# EAGLE design VK49_2.0 (EAGLE 9.6.2)
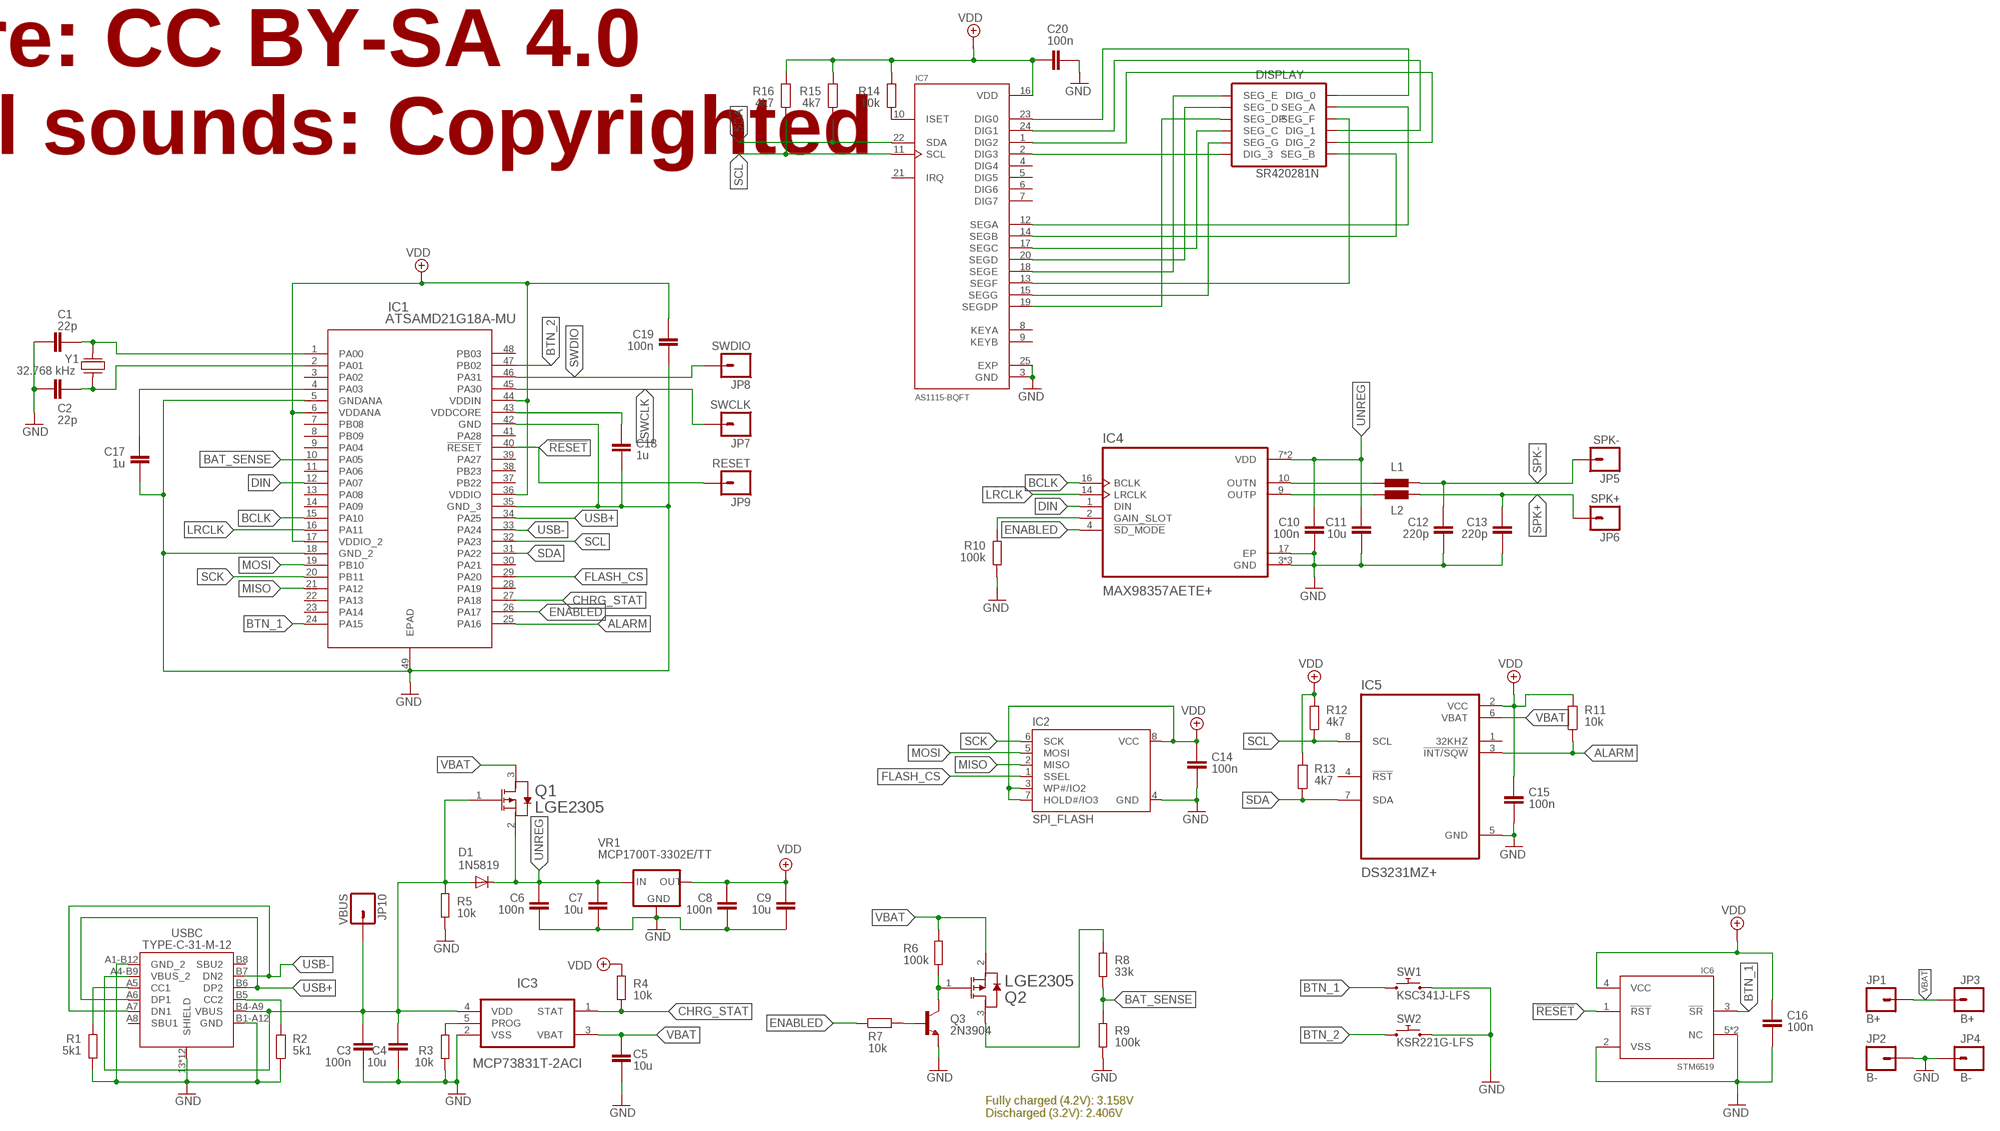
[diagram p0: schematic, sheet 1]

## Parts
C1  22p  CAPACITOR0603  [CAPACITOR0603]
C2  22p  CAPACITOR0603  [CAPACITOR0603]
C3  100n  CAPACITOR0603  [CAPACITOR0603]
C4  10u  CAPACITOR0805  [CAPACITOR0805]
C5  10u  CAPACITOR0805  [CAPACITOR0805]
C6  100n  CAPACITOR0603  [CAPACITOR0603]
C7  10u  CAPACITOR0805  [CAPACITOR0805]
C8  100n  CAPACITOR0603  [CAPACITOR0603]
C9  10u  CAPACITOR0805  [CAPACITOR0805]
C10  100n  CAPACITOR0603  [CAPACITOR0603]
C11  10u  CAPACITOR0805  [CAPACITOR0805]
C12  220p  CAPACITOR0603  [CAPACITOR0603]
C13  220p  CAPACITOR0603  [CAPACITOR0603]
C14  100n  CAPACITOR0603  [CAPACITOR0603]
C15  100n  CAPACITOR0603  [CAPACITOR0603]
C16  100n  CAPACITOR0603  [CAPACITOR0603]
C17  1u  CAPACITOR0603  [CAPACITOR0603]
C18  1u  CAPACITOR0603  [CAPACITOR0603]
C19  100n  CAPACITOR0603  [CAPACITOR0603]
C20  100n  CAPACITOR0603  [CAPACITOR0603]
D1  1N5819  CRS01  [SOD123]
DISPLAY  SR420281N  SEG_SR420281N_NOSILK  [SEG_SR420281N_NO-SILK]
IC1  ATSAMD21G18A-MU  [QFN-48-7X7]
IC2  SPI_FLASH  [SO08-EIAJ]
IC3  MCP73831T-2ACI  [SOT23-5]
IC4  MAX98357AETE+  [QFN50P300X300X80-17N]
IC5  DS3231MZ+  [SO8]
IC6  STM6519  [SON50P145X100X65-6N]
IC7  AS1115-BQFT  [QFN50P400X400X65-25N]
JP1  B+  M01_ROUND_NO_SILK  [1X01_ROUND_NOSILK]
JP2  B-  M01_ROUND_NO_SILK  [1X01_ROUND_NOSILK]
JP3  B+  M01_ROUND_NO_SILK  [1X01_ROUND_NOSILK]
JP4  B-  M01_ROUND_NO_SILK  [1X01_ROUND_NOSILK]
JP5  SPK-  M01_ROUND_NO_SILK  [1X01_ROUND_NOSILK]
JP6  SPK+  M01_ROUND_NO_SILK  [1X01_ROUND_NOSILK]
JP7  SWCLK  M01_ROUND_NO_SILK  [1X01_ROUND_NOSILK]
JP8  SWDIO  M01_ROUND_NO_SILK  [1X01_ROUND_NOSILK]
JP9  RESET  M01_ROUND_NO_SILK  [1X01_ROUND_NOSILK]
JP10  VBUS  M01_ROUND_NO_SILK  [1X01_ROUND_NOSILK]
L1  MMZ1608B121CTAH0  BLM15H0603  [0603]
L2  MMZ1608B121CTAH0  BLM15H0603  [0603]
Q1  LGE2305  [SOT23]
Q2  LGE2305  [SOT23]
Q3  2N3904  [SOT23]
R1  5k1  RESISTOR0603  [RESISTOR0603]
R2  5k1  RESISTOR0603  [RESISTOR0603]
R3  10k  RESISTOR0603  [RESISTOR0603]
R4  10k  RESISTOR0603  [RESISTOR0603]
R5  10k  RESISTOR0603  [RESISTOR0603]
R6  100k  RESISTOR0603  [RESISTOR0603]
R7  10k  RESISTOR0603  [RESISTOR0603]
R8  33k  RESISTOR0603  [RESISTOR0603]
R9  100k  RESISTOR0603  [RESISTOR0603]
R10  100k  RESISTOR0603  [RESISTOR0603]
R11  10k  RESISTOR0603  [RESISTOR0603]
R12  4k7  RESISTOR0603  [RESISTOR0603]
R13  4k7  RESISTOR0603  [RESISTOR0603]
R14  10k  RESISTOR0603  [RESISTOR0603]
R15  4k7  RESISTOR0603  [RESISTOR0603]
R16  4k7  RESISTOR0603  [RESISTOR0603]
SW1  KSC341J-LFS  KSC3XXJ  [KSC3XXJ]
SW2  KSR221G-LFS  KSR2XXG  [KSR2XXG]
USBC  TYPE-C-31-M-12  USB-C  [USB-C]
VR1  MCP1700T-3302E/TT  [SOT23]
Y1  32.768 kHz  CRYSTAL_3.2X1.5  [3.2X1.5-2-PAD]

## Nets
!RESET: IC1.40(!RESET) IC6.1(!RST) JP9.1
ALARM: IC1.25(PA16) IC5.3(!INT/SQW) R11.1
BAT_SENSE: IC1.10(PA05) R8.2 R9.1
BCLK: IC1.15(PA10) IC4.16(BCLK)
BTN_1: IC1.24(PA15) IC6.3(!SR) SW1.1 SW1.3
BTN_2: IC1.47(PB02) SW2.1
CHRG_STAT: IC1.27(PA18) IC3.1(STAT) R4.1
DIN: IC1.12(PA07) IC4.1(DIN)
ENABLED: IC1.26(PA17) IC4.4(!SD_MODE) R7.1
FLASH_CS: IC1.29(PA20) IC2.1(SSEL)
GND: C1.1 C2.1 C3.1 C4.2 C5.2 C6.1 C7.2 C8.1 C9.2 C10.1 C11.2 C12.1 C13.1 C14.1 C15.1 C16.1 C17.1 C18.1 C19.1 C20.1 IC1.5(GNDANA) IC1.18(GND_2) IC1.35(GND_3) IC1.42(GND) IC1.49(EPAD) IC2.4(GND) IC3.2(VSS) IC4.3(GND) IC4.11(GND) IC4.15(GND) IC4.17(EP) IC5.5(GND) IC6.2(VSS) IC6.5(NC) IC6.6(NC) IC7.3(GND) IC7.25(EXP) JP2.1 JP4.1 Q3.2(E) R1.1 R2.1 R3.2 R5.1 R9.2 R10.1 SW1.2 SW1.4 SW2.2 USBC.13(SHIELD) USBC.14(SHIELD) USBC.15(SHIELD) USBC.16(SHIELD) USBC.A1-B12(GND_2) USBC.B1-A12(GND) USBC.S_1_H1(SHIELD) USBC.S_1_H2(SHIELD) USBC.S_2_H1(SHIELD) USBC.S_2_H2(SHIELD) USBC.S_3_H1(SHIELD) USBC.S_3_H2(SHIELD) USBC.S_4_H1(SHIELD) USBC.S_4_H2(SHIELD) VR1.GND
LRCLK: IC1.16(PA11) IC4.14(LRCLK)
MISO: IC1.21(PA12) IC2.2(MISO)
MOSI: IC1.19(PB10) IC2.5(MOSI)
N$1: C1.2 IC1.1(PA00) Y1.1
N$2: C2.2 IC1.2(PA01) Y1.2
N$3: IC7.10(ISET) R14.1
N$4: R1.2 USBC.A5(CC1)
N$5: R2.2 USBC.B5(CC2)
N$6: C18.2 IC1.43(VDDCORE)
N$7: IC3.5(PROG) R3.1
N$8: IC4.10(OUTN) L1.1
N$9: IC4.9(OUTP) L2.1
N$10: IC4.2(GAIN_SLOT) R10.2
N$11: C17.2 IC1.4(PA03)
N$12: DISPLAY.12(DIG_0) IC7.23(DIG0)
N$13: DISPLAY.9(DIG_1) IC7.24(DIG1)
N$14: DISPLAY.8(DIG_2) IC7.1(DIG2)
N$15: DISPLAY.6(DIG_3) IC7.2(DIG3)
N$16: DISPLAY.11(SEG_A) IC7.12(SEGA)
N$17: DISPLAY.7(SEG_B) IC7.14(SEGB)
N$18: DISPLAY.4(SEG_C) IC7.17(SEGC)
N$19: DISPLAY.2(SEG_D) IC7.20(SEGD)
N$20: DISPLAY.1(SEG_E) IC7.18(SEGE)
N$21: DISPLAY.10(SEG_F) IC7.13(SEGF)
N$22: DISPLAY.5(SEG_G) IC7.15(SEGG)
N$23: DISPLAY.3(SEG_DP) IC7.19(SEGDP)
N$52: Q2.3(DRAIN) R8.1
N$67: Q2.1(GATE) Q3.3(C) R6.2
N$68: Q3.1(B) R7.2
SCK: IC1.20(PB11) IC2.6(SCK)
SCL: IC1.32(PA23) IC5.8(SCL) IC7.11(SCL) R12.1 R16.1
SDA: IC1.31(PA22) IC5.7(SDA) IC7.22(SDA) R13.1 R15.1
SPK+: C13.2 JP6.1 L2.2
SPK-: C12.2 JP5.1 L1.2
SWCLK: IC1.45(PA30) JP7.1
SWDIO: IC1.46(PA31) JP8.1
UNREG: C6.2 C7.1 C10.2 C11.1 D1.C IC4.7(VDD) IC4.8(VDD) Q1.2(SOURCE) VR1.VIN(IN)
USB+: IC1.34(PA25) USBC.A6(DP1) USBC.B6(DP2)
USB-: IC1.33(PA24) USBC.A7(DN1) USBC.B7(DN2)
VBAT: C5.1 IC3.3(VBAT) IC5.6(VBAT) JP1.1 JP3.1 Q1.3(DRAIN) Q2.2(SOURCE) R6.1
VBUS: C3.2 C4.1 D1.A IC3.4(VDD) JP10.1 Q1.1(GATE) R5.2 USBC.A4-B9(VBUS_2) USBC.B4-A9(VBUS)
VDD: C8.2 C9.1 C14.2 C15.2 C16.2 C19.2 C20.2 IC1.6(VDDANA) IC1.17(VDDIO_2) IC1.36(VDDIO) IC1.44(VDDIN) IC2.3(WP#/IO2) IC2.7(HOLD#/IO3) IC2.8(VCC) IC5.2(VCC) IC6.4(VCC) IC7.16(VDD) R4.2 R11.2 R12.2 R13.2 R14.2 R15.2 R16.2 VR1.VOUT(OUT)
Unconnected: IC1.3(PA02) IC1.7(PB08) IC1.8(PB09) IC1.9(PA04) IC1.11(PA06) IC1.13(PA08) IC1.14(PA09) IC1.22(PA13) IC1.23(PA14) IC1.28(PA19) IC1.30(PA21) IC1.37(PB22) IC1.38(PB23) IC1.39(PA27) IC1.41(PA28) IC1.48(PB03) IC5.1(32KHZ) IC5.4(!RST) IC7.4(DIG4) IC7.5(DIG5) IC7.6(DIG6) IC7.7(DIG7) IC7.8(KEYA) IC7.9(KEYB) IC7.21(IRQ) USBC.A8(SBU1) USBC.B8(SBU2)

## Notes on the sheet
- VK49 2.0
  Vaclav Mach (vaclavmach@hotmail.cz)
  Hardware: CC BY-SA 4.0
  Software: CC BY-SA 4.0
  Original sounds: Copyrighted
- Fully charged (4.2V): 3.158V
  Discharged (3.2V): 2.406V

## Library data of the parts
C1-C3 C6 C8 C10 C12-C20 = BASTL_CAPACITORS:CAPACITOR0603; ODOO: 0.1; SIZEX: 0.85; SIZEY: 1.55; SIZEZ: 0.8; TYPE: SMT
C4 C5 C7 C9 C11 = BASTL_CAPACITORS:CAPACITOR0805; ODOO: 0.1; SIZEX: 1.2; SIZEY: 2; SIZEZ: 1.2; TYPE: SMT
D1 = BASTL_DIODES:CRS01: diode instead of 1N4007; MAN: TOSHIBA; MPN: CRS01(TE85L,Q,M); ODOO: D_CRS01_SOD123F; PRICE: 2.1; SIZEX: 1.55; SIZEY: 2.65; SIZEZ: 0.9; TYPE: SMT; WEB: https://www.tme.eu/cz/details/crs01/diody-schottky-smd/toshiba/crs01-te85l-q-m/
DISPLAY = BASTL_LEDS:SEG_SR420281N
IC1 = BASTL_ICS:ATSAMD21G18A-MU; COPYRIGHT: Copyright (C) 2022 Ultra Librarian. All rights reserved.; DIGI-KEY_PART_NUMBER_1: ATSAMD21G18A-MUTCT-ND; DIGI-KEY_PART_NUMBER_2: ATSAMD21G18A-MUTDKR-ND; DIGI-KEY_PART_NUMBER_3: ATSAMD21G18A-MUTTR-ND; MANUFACTURER_PART_NUMBER: ATSAMD21G18A-MUT; MFR_NAME: Microchip
IC2 = BASTL_ICS:SPI_FLASH: Various SPI memory ICs: GD25Q64CSIG SST26VF064BT-104I/SM ...
IC3 = BASTL_ICS:MCP73831T-2ACI: Charge Management Controller; MPN: MCP73831T-2ACI/OT; OC_FARNELL: 1332158; OC_NEWARK: 56K7045; PACKAGE: SOT-5; SUPPLIER: Microchip
IC4 = BASTL_ICS:MAX98357AETE+: Audio Amp Speaker 1-CH Mono Class-D 16-Pin TQFN EP Check availability <https://pricing.snapeda.com/parts/MAX98357AETE%2B/Analog%20Devices/view-part?ref=eda>; AVAILABILITY: In Stock; DESCRIPTION: Tiny, Low-Cost, PCM Class D Amplifier with Class AB Performance; MF: Analog Devices; MP: MAX98357AETE+; PACKAGE: TQFN-16 Maxim; PRICE: None; PURCHASE-URL: https://pricing.snapeda.com/search/part/MAX98357AETE+/?ref=eda
IC5 = BASTL_ICS:DS3231MZ+; DESCRIPTION: Real Time Clock (RTC) IC Clock/Calendar I²C, 2-Wire Serial 8-SOIC (0.154, 3.90mm Width); DIGI-KEY_PART_NUMBER: DS3231MZ+-ND; MF: Maxim Integrated Products; MP: DS3231MZ+; PACKAGE: None
IC6 = BASTL_ICS:STM6519; DESCRIPTION: Cap Tant Solid 6.8uF 35V G CASE 10% (6.73 X 2.79 X 2.79mm) SMD (0.01%FR) T/R; MF: STMicroelectronics; MP: STM6519AHARUB6F; PACKAGE: UDFN-6 STMicroelectronics; PURCHASE-URL: https://pricing.snapeda.com/search/part/STM6519AHARUB6F/?ref=eda
IC7 = BASTL_ICS:AS1115-BQFT; DESCRIPTION: IC DRVR 64 LED 7SEG 8 DGT 24TQFN; DIGI-KEY_PART_NUMBER: AS1115-BQFTTR-ND; MF: ams; MP: AS1115-BQFT; PACKAGE: TQFN-24 ams; PURCHASE-URL: https://pricing.snapeda.com/search/part/AS1115-BQFT/?ref=eda
JP1-JP10 = BASTL_PINHEADERS:M01: Header 1 Standard 1-pin 0.1" header. Use with straight break away headers (SKU : PRT-00116), right angle break away headers (PRT-00553), swiss pins (PRT-00743), machine pins (PRT-00117), and female headers (PRT-00115).
L1 L2 = BASTL_INDUCTORS:BLM15H: EMIFIL (R) Chip Ferrite Bead for GHz Noise Source: http://www.murata.com/ Ferrite Bead BLM15H.pdf; SIZEX: 0.85; SIZEY: 1.55; SIZEZ: 0.5; TYPE: SMT
Q1 Q2 = BASTL_TRANZISTORS:LGE2305
Q3 = BASTL_TRANZISTORS:2N3904; ASSEMBLED: YES; MAN: ON SEMICONDUCTOR; MPN: MMBT3904LT1G; ODOO: TR_2N3904_SOT23; PRICE: 0.4; SIZEX: 2.92; SIZEY: 2.4; SIZEZ: 0.9; TYPE: SMT; WEB: https://www.tme.eu/cz/details/mmbt3904lt1g/tranzistory-npn-smd/on-semiconductor/
R1-R16 = BASTL_RESISTORS:RESISTOR0603; ASSEMBLED: yes; PRICE: 0.1; SIZEX: 0.85; SIZEY: 1.55; SIZEZ: 0.5; TYPE: SMT
SW1 = BASTL_SWITCHES:KSC3XXJ
SW2 = BASTL_SWITCHES:KSR2XXG
USBC = BASTL_CONNECTORS:USB-C: DigiKey: USB4105-GF-A LCSC: C165948
VR1 = BASTL_VOLTAGE REGULATORS:MCP1700T-3302E/TT
Y1 = BASTL_CRYSTALS, RESNATORS:CRYSTAL_3.2X1.5: Various 3.2 x 1.5 mm SMD crystals Eg. LFXTAL009678REEL

## Board
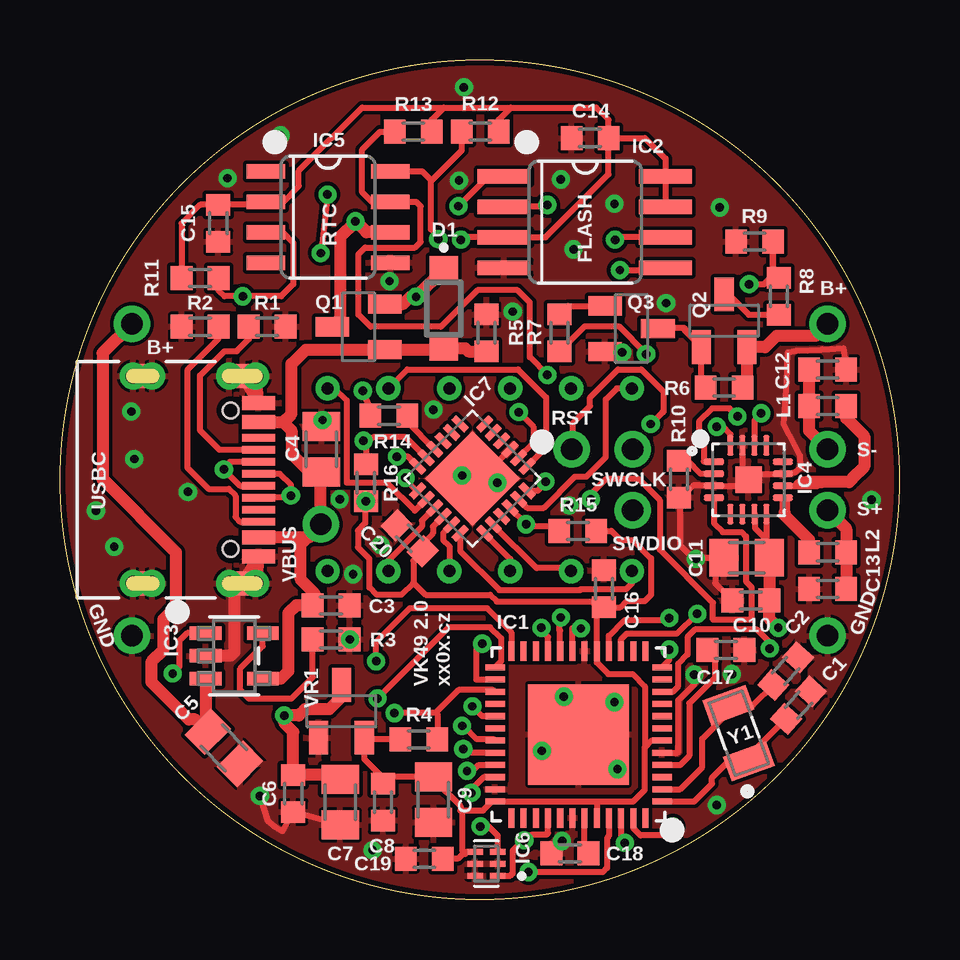
[diagram p1: board, top side]
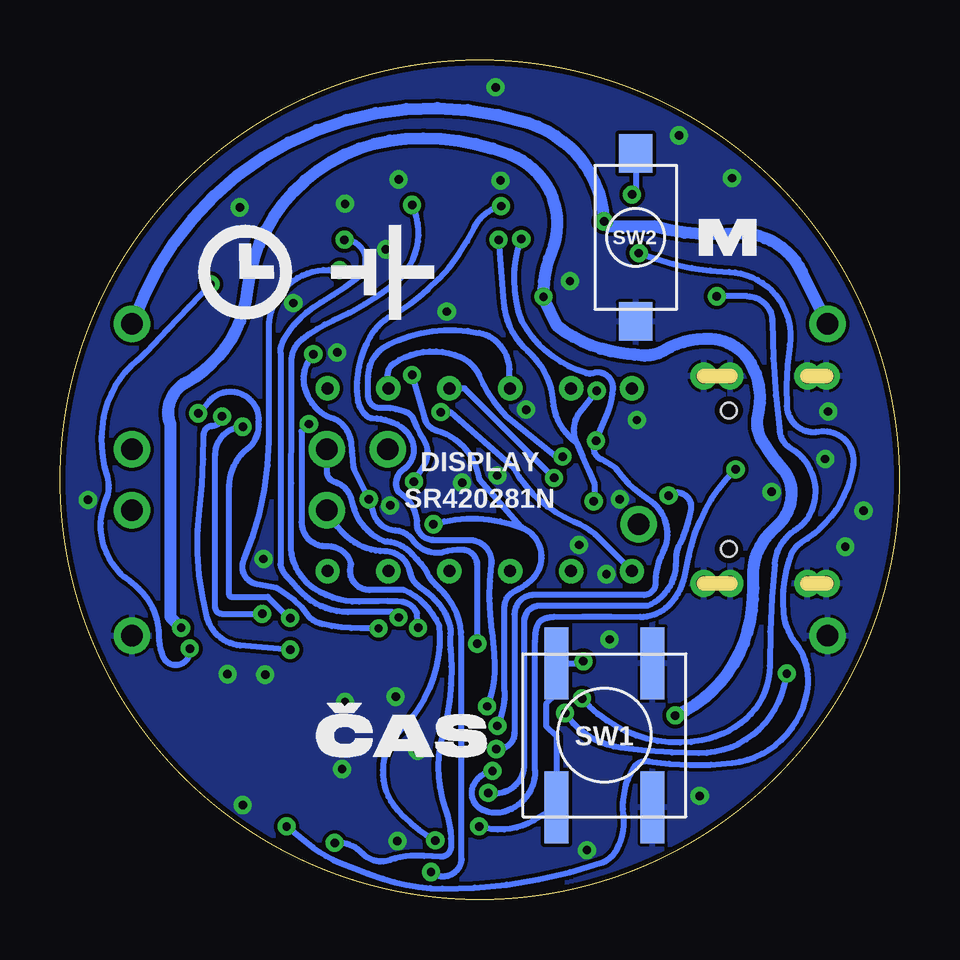
[diagram p2: board, bottom side, seen from below]

Size 35 x 35 mm. Coordinates in mm from the lower left corner, seen from the top.
Outline: circle at 17.5,17.5 radius 17.5
Copper layers (1*16): Top 0.035mm / dielectric 1.5mm / Bottom 0.035mm
Design rules "default_tenting_vias *": minimum track width 6mil, minimum drill 0.35mm, track to track 6mil, track to pad 6mil, pad to pad 6mil, via to via 6mil, smd to smd 6mil, copper to edge 10mil, drill to drill 6mil, minimum pad ring 10mil, minimum via ring 8mil, stop-mask expansion 4mil, vias tented up to drill 15mil, thermal gap 5mil

### Footprints (pad centres in the part's own frame; a part is rotated, then mirrored left to right if it is on the bottom)
CAPACITOR0603 = smd 0.9 x 1: 1 -0.771,0; 2 0.771,0
CAPACITOR0805 = smd 1.2 x 1.55: 1 -0.95,0; 2 0.95,0
SOD123 = smd 1.05 x 1.2: A 1.654,0; C -1.654,0
SEG_SR420281N_NO-SILK = drill 0.5: 1 -6.35,-3.81; 2 -3.81,-3.81; 3 -1.27,-3.81; 4 1.27,-3.81; 5 3.81,-3.81; 6 6.35,-3.81; 7 6.35,3.81; 8 3.81,3.81; 9 1.27,3.81; 10 -1.27,3.81; 11 -3.81,3.81; 12 -6.35,3.81
QFN-48-7X7 = smd 0.813 x 0.254: 1 -3.48,2.794; 2 -3.48,2.286; 3 -3.48,1.778; 4 -3.48,1.27; 5 -3.48,0.762; 6 -3.48,0.254; 7 -3.48,-0.254; 8 -3.48,-0.762; 9 -3.48,-1.27; 10 -3.48,-1.778; 11 -3.48,-2.286; 12 -3.48,-2.794; 25 3.48,-2.794; 26 3.48,-2.286; 27 3.48,-1.778; 28 3.48,-1.27; 29 3.48,-0.762; 30 3.48,-0.254; 31 3.48,0.254; 32 3.48,0.762; 33 3.48,1.27; 34 3.48,1.778; 35 3.48,2.286; 36 3.48,2.794 | smd 0.254 x 0.813: 13 -2.794,-3.48; 14 -2.286,-3.48; 15 -1.778,-3.48; 16 -1.27,-3.48; 17 -0.762,-3.48; 18 -0.254,-3.48; 19 0.254,-3.48; 20 0.762,-3.48; 21 1.27,-3.48; 22 1.778,-3.48; 23 2.286,-3.48; 24 2.794,-3.48; 37 2.794,3.48; 38 2.286,3.48; 39 1.778,3.48; 40 1.27,3.48; 41 0.762,3.48; 42 0.254,3.48; 43 -0.254,3.48; 44 -0.762,3.48; 45 -1.27,3.48; 46 -1.778,3.48; 47 -2.286,3.48; 48 -2.794,3.48 | smd 4.191 x 4.191: 49 0,0
SO08-EIAJ = smd 0.61 x 2.21: 1 -1.905,-3.378; 2 -0.635,-3.378; 3 0.635,-3.378; 4 1.905,-3.378; 5 1.905,3.353; 6 0.635,3.353; 7 -0.635,3.353; 8 -1.905,3.353
SOT23-5 = smd 1.321 x 0.559: 1 -1.194,0.95; 2 -1.194,0; 3 -1.194,-0.95; 4 1.194,-0.95; 5 1.194,0.95
QFN50P300X300X80-17N = smd 0.86 x 0.27: 1 -1.435,0.75; 2 -1.435,0.25; 3 -1.435,-0.25; 4 -1.435,-0.75; 9 1.435,-0.75; 10 1.435,-0.25; 11 1.435,0.25; 12 1.435,0.75 | smd 0.27 x 0.86: 5 -0.75,-1.435; 6 -0.25,-1.435; 7 0.25,-1.435; 8 0.75,-1.435; 13 0.75,1.435; 14 0.25,1.435; 15 -0.25,1.435; 16 -0.75,1.435 | smd 1.1 x 1.1: 17 0,0
SO8 = smd 1.6 x 0.6: 1 -2.6,1.905; 2 -2.6,0.635; 3 -2.6,-0.635; 4 -2.6,-1.905; 5 2.6,-1.905; 6 2.6,-0.635; 7 2.6,0.635; 8 2.6,1.905
SON50P145X100X65-6N = smd 0.65 x 0.25: 1 -0.475,0.5; 2 -0.475,0; 3 -0.475,-0.5; 4 0.475,-0.5; 5 0.475,0; 6 0.475,0.5
QFN50P400X400X65-25N = smd 0.76 x 0.3: 1 -1.975,1.25; 2 -1.975,0.75; 3 -1.975,0.25; 4 -1.975,-0.25; 5 -1.975,-0.75; 6 -1.975,-1.25; 13 1.975,-1.25; 14 1.975,-0.75; 15 1.975,-0.25; 16 1.975,0.25; 17 1.975,0.75; 18 1.975,1.25 | smd 0.3 x 0.76: 7 -1.25,-1.975; 8 -0.75,-1.975; 9 -0.25,-1.975; 10 0.25,-1.975; 11 0.75,-1.975; 12 1.25,-1.975; 19 1.25,1.975; 20 0.75,1.975; 21 0.25,1.975; 22 -0.25,1.975; 23 -0.75,1.975; 24 -1.25,1.975 | smd 2.8 x 2.8: 25 0,0
1X01_ROUND_NOSILK = drill 0.889 pad 1.524: 1 0,0
0603 = smd 0.9 x 1: 1 -0.771,0; 2 0.771,0
SOT23 = smd 0.8 x 1.4: 1 -0.95,-1.1; 2 0.95,-1.1; 3 0,1.1
RESISTOR0603 = smd 0.9 x 1: 1 -0.771,0; 2 0.771,0
KSC3XXJ = smd 3 x 1: 1 -3,2; 2 -3,-2; 3 3,2; 4 3,-2
KSR2XXG = smd 1.6 x 1.4: 1 -3.5,0; 2 3.5,0
USB-C = smd 0.991 x 1.803: 13 -4.32,-1.269; 14 4.32,-1.269 | smd 0.991 x 2.108: 15 -4.32,2.911; 16 4.32,2.911 | smd 0.584 x 1.372: A1-B12 -3.2,3.581; A4-B9 -2.4,3.581; B1-A12 3.2,3.581; B4-A9 2.4,3.581 | smd 0.305 x 1.372: A5 -1.25,3.581; A6 -0.25,3.581; A7 0.25,3.581; A8 1.25,3.581; B5 1.75,3.581; B6 0.75,3.581; B7 -0.75,3.581; B8 -1.75,3.581 | drill 0.61 pad 0.61: S_1_H1 -4.318,-0.864; S_1_H2 -4.318,-1.651; S_2_H1 4.318,-0.864; S_2_H2 4.318,-1.651; S_3_H1 -4.318,3.454; S_3_H2 -4.318,2.362; S_4_H1 4.318,3.454; S_4_H2 4.318,2.362 | hole 0.65: 2.896,2.413; -2.896,2.413
SOT23' = smd 0.8 x 1.4: GND -0.95,-1.1; VIN 0,1.1; VOUT 0.95,-1.1
3.2X1.5-2-PAD = smd 1.1 x 1.9: 1 -1.25,0; 2 1.25,0

### Placement (x,y rotation side)
C1  30.78,8.1 228 top
C2  30.25,9.53 228 top
C3  11.3,12.27 180 top
C4  10.9,18.77 90 top
C5  6.83,6.32 315 top
C6  9.73,4.42 90 top
C7  11.68,4.06 270 top
C8  13.46,4.06 90 top
C9  15.57,4.17 270 top
C10  28.8,12.47 0 top
C11  28.63,14.25 180 top
C12  32,22.1 180 top
C13  32,12.95 0 top
C14  22.1,31.75 0 top
C15  6.6,28.19 90 top
C16  22.68,12.95 270 top
C17  27.76,10.41 180 top
C18  21.26,1.93 0 top
C19  15.19,1.7 0 top
C20  14.58,15.06 315 top
D1  16,24.64 270 top
DISPLAY  17.5,17.5 0 bottom
IC1  21.62,6.88 180 top
IC2  21.89,28.24 270 top
IC3  7.26,10.16 0 top
IC4  28.7,17.5 0 top
IC5  11.18,28.45 0 top
IC6  17.78,1.5 180 top
IC7  17.2,17.55 225 top
JP1  3,24 0 top
JP2  3,11 0 top
JP3  32,24 0 top
JP4  32,11 0 top
JP5  32,18.77 0 top
JP6  32,16.23 0 top
JP7  23.88,18.77 0 top
JP8  23.88,16.23 0 top
JP9  21.34,18.77 0 top
JP10  10.87,15.65 0 top
L1  32,20.57 180 top
L2  32,14.48 0 top
Q1  12.45,23.88 90 top
Q2  27.69,24.13 0 top
Q3  23.83,23.8 270 top
R1  8.64,23.88 180 top
R2  5.84,23.88 0 top
R3  11.3,10.85 0 top
R4  14.96,6.68 180 top
R5  17.78,23.62 270 top
R6  27.69,21.34 180 top
R7  20.83,23.62 90 top
R8  29.97,25.15 90 top
R9  28.96,27.43 180 top
R10  25.81,17.53 90 top
R11  5.84,25.91 180 top
R12  17.53,32 0 top
R13  14.73,32 0 top
R14  13.72,20.17 180 top
R15  21.59,15.37 0 top
R16  12.75,17.37 270 top
SW1  12.3,6.85 90 bottom
SW2  11,27.6 270 bottom
USBC  4.7,17.5 270 top
VR1  MCP1700T-3302E/TT  [SOT23']  11.73,7.85 0 top
Y1  28.3,6.93 110 top

### Tracks (layer width: path | path; a pad name or v marks a point on that pad's centre or on a via)
!RESET  (via drill 0.35)
  Top 0.254: IC6.1 18.78,1 18.87,1.09 18.87,2.03 19.3,2.46 v19.36,2.46 19.43,2.46 19.68,2.72 20.3,2.72 20.34,2.77 IC1.40 | JP9.1 21.36,18.8 21.36,19.84 22.1,20.57 22.1,20.93 23.27,22.1 24.23,22.1 25.15,21.18 25.15,20.31 25.11,20.31 v24.62,19.82
  Bottom 0.254: v24.62,19.82 24.93,19.52 24.93,15.73 arc-93 23.88,14.73 arc79 22.86,13.97 arc-109 22.1,12.9 20.65,12.9 arc40 19.2,11.45 arc35 19.81,8.38 arc17 20.83,7.04 arc-87 20.93,3.73 arc-18 v19.36,2.46
ALARM  (via drill 0.35)
  Top 0.254: IC1.25 18.39,9.93 18.39,10.9 17.93,11.35 16.2,11.35 v13.23,8.38 | R11.1 6.61,25.39 6.86,25.15 v7.62,25.15 9.22,25.15 9.73,25.65 9.73,27.38 9.3,27.81 IC5.3
  Bottom 0.254: v13.23,8.38 v13.23,8.38 arc-61 8.23,6.64 arc-26 6.61,7.36 arc-53 5.41,9.75 arc5 5.21,13.99 arc51 4.37,15.39 arc-17 3.86,15.85 arc-94 4.55,18.82 arc52 4.99,19.49 arc8 5.3,24.1 arc-90 6.35,25.15 v7.62,25.15
BAT_SENSE  (via drill 0.35)
  Top 0.254: R8.2 29.73,26.16 R9.1 29.73,26.04 29.35,25.65 v28.73,25.65 | IC1.10 25.55,8.66 25.78,8.89 25.78,9.83 26.16,10.21 26.16,10.95 26.47,11.25 29.06,11.25 29.59,10.72 v29.59,10.46
  Bottom 0.254: v28.73,25.65 arc-1 31.39,22.84 arc8 31.77,22.48 arc-41 33.17,20.09 arc-27 33.02,17.63 arc40 33.07,16.69 arc-78 32.09,13.27 arc55 30.88,10.95 arc-24 30.71,10.13 arc-166 v29.59,10.46
BCLK  (via drill 0.35)
  Top 0.254: IC1.15 23.39,10.85 23.62,11.07 25.7,11.07 26.54,11.91 v26.57,11.91 | IC4.16 27.95,19.39 27.63,19.71 v27.38,19.71
  Bottom 0.254: v26.57,11.91 28.27,11.91 arc90 28.52,12.17 28.52,18.54 arc89 v27.38,19.71
BTN_1  (via drill 0.35)
  Top 0.254: v13.18,9.93 13.18,10.74 14.58,12.14 17.8,12.14 18.82,11.12 IC1.24 | v17.53,3.05 17.87,3.05 18.25,2.66 IC6.3
  Bottom 0.254: v13.18,9.93 13.26,9.85 SW1.3 14.3,8.58 14.73,8.15 14.73,7.23 14.3,6.8 SW1.1 15.24,3.3 arc48 v17.53,3.05
BTN_2  (via drill 0.35)
  Top 0.254: IC1.47 23.9,2.97 24.21,2.67 25.17,2.67 v25.55,3.05 | v11.15,29.39 v10.88,26.95 v10.87,26.95
  Bottom 0.254: v25.55,3.05 24.46,2.18 arc-17 23.32,1.52 arc-3 21.54,0.87 arc-18 19.05,0.46 arc-19 12.45,1.52 arc-43 11.79,2.08 arc-35 11.51,3.53 arc37 11.1,5.46 arc69 10.46,5.76 arc-15 6.99,5.69 arc-79 3.81,8.99 arc-42 4.32,10.67 arc32 4.83,11.94 arc24 4.57,14.22 arc45 4.12,14.86 arc-19 2.87,15.95 arc-32 1.93,18.14 arc-108 3.38,19.51 arc98 4.7,20.56 arc11 4.57,23.11 arc-96 7.11,26.16 arc16 10.19,26.72 v10.87,26.95 | v11.15,29.39 11,29.39 SW2.1
CHRG_STAT  (via drill 0.35)
  Top 0.254: IC1.27 18.06,8.74 16.61,8.74 15.67,7.8 | IC3.1 5.31,11.11 4.98,10.78 4.98,9.7 v4.7,9.42 | v13.95,7.77 13.97,7.8 15.67,7.8 | 15.67,7.8 15.73,7.74 R4.1
  Bottom 0.254: v4.7,9.42 4.83,8.89 arc77 8.38,6.1 arc8 11.63,6.33 arc48 v13.95,7.77
DIN  (via drill 0.35)
  Top 0.254: IC1.12 25.4,9.98 v25.4,10.41 | v28.25,20.14 27.91,20.47 27.18,20.47 26.64,19.94 26.64,19.28 26.84,19.09 26.84,18.27 26.86,18.25 IC4.1
  Bottom 0.254: v28.25,20.14 arc90 28.64,19.75 arc-90 29.01,19.38 arc7 29.18,16.28 arc-22 28.85,11.73 arc-70 27.48,10.59 v25.4,10.41
ENABLED  (via drill 0.35)
  Top 0.254: IC4.4 27.27,15.68 27.64,15.32 28.42,15.32 28.6,15.14 28.6,13.26 28.83,13.03 28.83,11.66 27.23,11.66 27.23,12.37 25.01,14.59 25.01,16.65 24.13,17.53 22.76,17.53 22.12,16.89 v22.12,16.69 | v17.6,10.67 17.35,10.41 17.35,9.17 IC1.26 | R7.1 21.88,23.9 23.29,23.9 24.43,22.76 v24.43,22.73
  Bottom 0.254: v17.6,10.67 17.6,13.95 arc-90 18.24,14.58 arc-14 19.05,14.48 arc64 20.3,14.99 arc-50 21.03,15.39 arc68 21.92,16.08 v22.12,16.69 22.73,17.93 arc22 22.76,18.02 arc-3 22.85,19.05 arc-60 23.62,20.07 arc24 24.13,20.32 arc35 24.79,21.32 arc55 24.54,22.61 24.54,22.63 v24.43,22.73
FLASH_CS  (via drill 0.35)
  Top 0.254: IC1.29 17.6,7.64 v17.2,8.05 | v16.61,28.91 17.86,30.15 IC2.1
  Bottom 0.254: v17.2,8.05 arc-25 16.88,9.79 arc-5 16.99,11.18 arc13 17.02,13.97 arc-96 17.93,14.99 19.43,14.99 arc90 20.12,15.67 20.12,15.75 arc-52 20.85,16.97 arc34 20.94,17.07 arc80 20.68,17.93 arc-19 20.46,18.14 arc-56 20.3,19.06 arc-38 20.8,19.71 arc-34 21.97,20.07 arc44 22.23,20.17 arc40 22.58,20.88 arc36 22.07,23.45 arc31 21.16,24.36 arc-12 19.67,25.42 arc-23 17.72,28.02 arc52 v16.61,28.91
GND  (via drill 0.35)
  Top 0.254: R10.1 25.9,16.75 | 25.9,16.75 25.87,16.73 25.87,14.77 26.39,14.25 C11.2 27.32,13.89 27.32,13.18 C10.1 | 25.9,16.75 26.42,17.27 27.25,17.27 IC4.3 28.45,17.25 IC4.17 | IC4.15 28.45,17.75 IC4.17 | IC4.17 28.95,17.75 IC4.11 30.66,17.83 30.89,18.01 30.86,18.49 30.18,19.81 30.3,21.57 30.35,22.81 30.68,22.89 31.77,22.94 32.66,22.99 C12.1 | IC7.3 17.55,17.55 IC7.25 v18.24,17.37 | v8.33,4.32 8.66,3.28 8.94,3.05 9.27,2.85 C6.1 C7.2 | v20.09,6.2 20.18,6.29 IC1.49 22.99,8.23 v23.11,8.23 | IC1.5 25.76,6.12 25.78,6.15 25.78,8.31 26.47,8.99 26.47,9.35 v26.44,9.37 | C18.1 v20.93,2.44
  Top 0.508: USBC.16 7.26,12.83 7.26,10.31 7.11,10.16 IC3.2 | USBC.15 USBC.A1-B12 USBC.S_3_H1 | USBC.16 USBC.S_4_H1 USBC.B1-A12 USBC.16
  other vias: 21.41,27.1 23.11,29.01 20.88,30.02 27.51,28.85 23.24,5.44 2.26,14.71 3.1,18.36 2.97,20.35 1.5,16.21 15.57,20.42 12.22,13.56 16.76,17.68 6.99,30.07 16.84,33.86 9.19,31.85 25.27,24.87 33.83,16.66 21.01,8.46 13.03,2.06 23.44,22.81 26.52,14.2 13.36,14.78 5.33,16.99 10.95,19.99 13.74,25.78 16.64,29.97 18.87,24.51 28.02,9.4 21.23,16.43 12.09,10.85 27.38,3.94 11.66,16.69
  pour Bottom: 0,35 35,35 35,0 0,0
  pour Top: 0,35 35,35 35,0 0,0
LRCLK  (via drill 0.35)
  Top 0.254: IC1.16 22.89,11 23.52,11.63 25.3,11.63 v25.4,11.73 | v29.23,20.27 28.95,19.99 IC4.14
  Bottom 0.254: v25.4,11.73 arc-59 25.45,11.79 25.5,11.79 26.34,12.62 27.86,12.62 arc90 27.94,12.7 27.94,17.22 arc52 27.18,18.8 arc-60 26.72,19.94 arc-141 28.77,20.79 v29.23,20.27
MISO  (via drill 0.35)
  Top 0.254: IC1.21 20.34,10.95 19.99,11.3 19.99,11.33 v20.07,11.33 | v20.32,28.96 20.24,28.88 IC2.2
  Bottom 0.254: v20.07,11.33 20.12,11.89 arc-68 20.75,12.42 arc-7 21.34,12.45 arc0 22.53,12.42 arc34 24.38,12.95 arc57 25.38,14.81 arc-1 25.35,22.43 arc52 24.89,23.37 arc14 23.62,24.13 arc-14 21.08,25.65 arc-78 v20.32,28.96
MOSI  (via drill 0.35)
  Top 0.254: IC1.19 21.36,11.3 v21.72,11.3 | IC2.5 25.12,26.21 23.37,26.21 v23.34,26.24
  Bottom 0.254: v23.34,26.24 23.34,26.19 arc-103 26.29,23.82 26.29,19.11 arc22 27.33,14.17 arc-102 26.79,13.14 25.96,12.98 25.22,12.47 24.92,12.19 24.59,11.76 arc-30 24.07,11.48 arc-13 22.45,11.3 v21.72,11.3
N$1
  Top 0.254: IC1.1 26.44,4.09 27.18,4.83 27.18,5.08 27.86,5.76 Y1.1 28.72,5.98 C1.2
N$2
  Top 0.254: IC1.2 25.86,4.6 26.77,5.51 26.77,6.71 27.87,7.8 Y1.2 28.89,8.11 C2.2
N$3
  Top 0.254: IC7.10 14.49,19.91 R14.1
N$4
  Top 0.254: USBC.A5 6.65,18.75 5.84,19.56 5.84,21.84 6.86,22.86 7.37,22.86 7.87,23.36 R1.2
N$5
  Top 0.254: R2.2 6.61,23.38 5.31,22.07 5.31,18.01 6.2,17.12 7.04,17.12 7.32,16.84 7.32,15.95 7.52,15.75 USBC.B5
N$6
  Top 0.254: C18.2 21.87,2.09 IC1.43
N$7
  Top 0.254: IC3.5 8.46,10.57 7.52,9.63 7.52,8.74 7.87,8.38 9.65,8.38 10.53,9.26 R3.1
N$8
  Top 0.254: 30.61,17.25 IC4.10 31.6,17.25 31.75,17.4 | 30.61,17.25 30.94,17.25 31.09,17.4 30.83,17.4 | 30.83,17.4 30.76,17.4 30.61,17.25 | 30.83,17.4 30.96,17.53 33.02,17.53
  Top 0.508: L1.1 32.77,20.07 33.53,19.31 33.53,18.03 33.02,17.53 32.89,17.4 31.75,17.4 31.09,17.4
N$9
  Top 0.254: IC4.9 30.3,16.59 30.3,15.93 | IC4.9 30.14,16.22 30.2,16.15 | 30.2,16.03 30.14,16.09 IC4.9
  Top 0.508: 30.2,16.15 30.2,16.03 30.3,15.93 31.23,14.99 L2.1
N$10
  Top 0.254: IC4.2 26.7,17.75 26.15,18.3 R10.2
N$11
  Top 0.254: C17.2 27.3,10.11 27.3,9.24 26.24,8.18 26.24,5.99 25.86,5.61 IC1.4
N$12
  Top 0.254: IC7.23 19.47,16.33 20.17,16.33 21.46,17.63 21.95,17.63 22.76,18.44 22.76,20.85 23.21,21.31 DISPLAY.12
N$13  (via drill 0.35)
  Top 0.254: v20.24,17.42 20.24,17.37 19.91,17.04 IC7.24
  Bottom 0.254: DISPLAY.9 16.26,22.1 arc-76 17.53,23.62 arc-38 21.34,23.11 arc-63 22.15,21.79 22.15,20.98 arc-90 21.67,20.5 arc24 20.57,20.32 arc48 20.24,19.99 arc-11 19.81,19.13 arc64 19.81,18.11 v20.24,17.42
N$14
  Top 0.254: DISPLAY.8 14.48,22.1 19.1,22.1 20.27,20.93 20.27,18.85 IC7.1
N$15  (via drill 0.35)
  Top 0.254: v19.13,20.32 19.73,19.71 19.73,19.03 IC7.2
  Bottom 0.254: DISPLAY.6 12.5,15.04 arc-23 13.56,15.75 arc39 16.08,17.98 18.72,20.32 arc-39 v19.13,20.32
N$16  (via drill 0.35)
  Top 0.254: IC7.12 14.51,18.47 v14.05,18.47
  Bottom 0.254: DISPLAY.11 21.34,21.84 arc59 21.08,22.35 arc58 18.29,22.61 arc43 17.53,21.84 arc-20 16.4,20.15 14.32,18.47 arc-14 v14.05,18.47
N$17
  Top 0.254: DISPLAY.7 11.46,21.31 11.96,20.8 11.96,17.37 13.64,17.37 14.8,16.21 IC7.14
N$18
  Top 0.254: IC7.17 15.98,15.27 15.98,14.98 16.23,14.73 DISPLAY.4
N$19
  Top 0.254: IC7.20 19.87,13.82 21.18,13.82 DISPLAY.2
N$20
  Top 0.254: IC7.18 16.68,14.53 18.31,12.9 21.69,12.9 21.72,12.93 23.6,12.93 23.85,13.18 DISPLAY.1
N$21  (via drill 0.35)
  Top 0.254: IC7.13 14.86,17.04 14.38,17.53 14.4,17.55 v14.4,17.58
  Bottom 0.254: v14.4,17.58 18.14,21.31 DISPLAY.10
N$22
  Top 0.254: DISPLAY.5 13.69,14.14 15.09,15.54 15.09,15.8 IC7.15
N$23
  Top 0.254: IC7.19 18.77,14.21 DISPLAY.3
N$52
  Top 0.254: Q2.3 27.86,25.23 28.71,24.38 R8.1
N$67
  Top 0.254: R6.2 26.74,21.52 Q2.1 26.04,23.72 26.04,23.82 24.94,23.82 Q3.3
N$68
  Top 0.254: R7.2 21.18,24.75 Q3.1
SCK  (via drill 0.35)
  Top 0.254: IC1.20 20.85,11.2 20.8,11.25 20.8,11.68 v20.88,11.76 | IC2.6 23.24,27.61 v23.14,27.51
  Bottom 0.254: v20.88,11.76 20.9,11.76 21.13,11.99 23,11.99 arc44 24.89,12.77 arc1 25.55,13.47 arc30 25.81,13.97 25.81,22.81 arc31 25.65,23.37 arc29 24.13,24.89 arc-6 22.61,25.91 arc-143 v23.14,27.51
SCL  (via drill 0.35)
  Top 0.254: IC7.11 14.41,19.28 13.06,19.28 12.9,19.13 v12.65,19.13 12.75,19.02 R16.1 | IC1.32 16.97,6.12 v16.82,6.27 | v15.77,27.53 15.77,27.64 15.47,27.94 15.47,30 | IC5.8 15.11,30.35 15.47,30 | 15.47,30 15.49,29.97 16.75,31.23 R12.1
  Bottom 0.254: v15.77,27.53 arc-40 15.74,24.11 arc-44 13.06,21.95 arc-33 12.77,21.95 arc111 11.94,21.28 arc18 12.16,20.31 v12.65,19.13 arc-98 12.46,18.36 arc8 11.84,17.98 arc6 11.8,17.94 arc-21 10.45,16.66 arc44 9.72,15.63 arc40 9.86,14.48 arc-27 10.16,13.21 arc90 10.67,12.7 15.24,12.7 arc-90 16.05,11.89 16.05,6.96 arc96 v16.82,6.27
SDA  (via drill 0.35)
  Top 0.254: IC7.22 19.43,15.67 v19.43,15.65 19.53,15.54 20.83,15.54 R15.1 | IC1.31 18.09,6.68 17.37,6.68 16.82,7.24 v16.76,7.24 | v20.32,21.87 19.58,22.61 19.58,24.89 19.07,25.4 17.4,25.4 15.88,23.88 12.95,23.88 12.45,24.38 12.45,26.9 12.72,27.18 14.81,27.18 15.04,27.41 15.04,28.91 14.86,29.08 IC5.7 13.01,29.08 12.6,29.49 12.6,31.27 13.34,32 R13.1
  Bottom 0.254: v16.76,7.24 arc-24 16.46,8.68 16.46,12.25 arc48 16.26,12.7 arc16 15.88,12.95 arc-23 15.24,13.44 arc-110 15.75,15.49 arc66 15.76,15.5 15.78,15.53 | v19.43,15.65 arc37 15.76,15.51 15.78,15.53 | v20.32,21.87 19.81,20.07 arc-59 19.3,19.56 arc66 17.53,17.53 15.78,15.53
SPK+
  Top 0.508: JP6.1 32.77,15.46 L2.2 C13.2
SPK-
  Top 0.508: JP5.1 31.23,19.54 L1.2 C12.2
SWCLK  (via drill 0.35)
  Top 0.254: IC1.45 22.89,2.64 22.81,2.56 22.81,1.32 22.63,1.14 v19.53,1.14
  Bottom 0.254: v19.53,1.14 arc-131 18.26,1.73 18.26,10.88 arc-47 19.18,12.96 arc23 19.79,13.8 arc-9 20.29,14.37 arc1 20.4,14.48 arc-46 21.48,14.94 arc57 22.84,16.61 arc-63 23.57,17.42 arc74 23.88,17.83 JP7.1
SWDIO  (via drill 0.35)
  Top 0.254: v23.55,2.36 23.39,2.52 IC1.46
  Bottom 0.254: JP8.1 arc-28 22.86,14.99 arc-37 21.45,14.52 arc80 20.41,13.63 arc-34 20.19,13.2 arc-13 19.88,12.94 arc38 18.77,11.52 arc24 18.72,11.1 arc-9 18.72,10.44 arc20 19.05,6.86 arc-34 18.95,3.8 arc21 18.69,2.21 arc94 19.15,1.78 arc-3 20.14,1.83 arc-21 21.23,1.65 arc66 22.4,1.93 arc-52 v23.55,2.36
UNREG  (via drill 0.35)
  Top 0.254: IC4.8 29.45,14.37 C11.1 29.58,14.88 28.98,15.48 28.98,16.04 IC4.7
  Top 0.508: Q1.2 14.31,24.83 14.61,25.13 v14.84,25.13 D1.C | C7.1 11.51,5.19 C6.2 9.73,6.99 9.35,7.37 v9.35,7.67 9.95,7.67 10.21,7.93 11.23,7.93 11.73,8.44 VR1.VIN | C11.1 C10.2 29.57,11.7 v29.95,11.33
  Bottom 0.508: v29.95,11.33 30.4,11.79 30.4,19.83 arc80 29.74,21.56 arc-55 27.18,25.4 arc80 20.59,31.71 arc25 16.25,31.06 arc92 14.51,27 arc-25 v14.84,25.13 arc-25 14.84,25.05 14.3,23.93 arc-31 11.63,22.79 arc-3 10.74,22.68 arc-36 9.83,22.89 arc34 7.85,23.37 arc57 6.2,22.35 arc44 5.89,20.22 arc-51 5.64,18.99 arc-11 4.88,17.96 arc39 4.5,17.02 arc50 5.11,15.57 arc-9 5.56,15.09 arc-42 6.1,13.45 arc14 6.22,11.61 arc55 v9.35,7.67
USB+  (via drill 0.35)
  Top 0.254: IC1.34 17.68,5.11 17.14,4.57 v17.14,4.45 | USBC.B6 8.29,16.76 9.55,16.76 v9.63,16.84 9.63,17.3 9.17,17.75 USBC.A6
  Bottom 0.254: v17.14,4.45 arc-103 15.65,5.64 15.65,11.61 arc90 15.01,12.24 10.52,12.24 arc-71 9.31,14.1 arc29 9.14,14.86 arc-19 8.69,16.28 arc-136 v9.63,16.84
USB-  (via drill 0.35)
  Top 0.254: USBC.B7 7.07,18.25 6.83,18.01 v6.83,17.93 7.51,17.25 USBC.A7 | v16.97,5.36 17.2,5.36 17.45,5.61 IC1.33
  Bottom 0.254: v16.97,5.36 arc-56 17.76,4.77 arc-47 17.78,4.17 arc-47 17.32,3.71 arc-43 16.32,3.71 arc-69 15.19,5.37 15.19,10.74 arc14 15.11,11.38 arc52 14.86,11.68 arc23 14.4,11.79 arc2 10.82,11.79 arc-40 9.74,12.16 arc-40 8.96,13.48 arc3 8.67,14.74 arc31 v6.83,17.93
VBAT  (via drill 0.35)
  Top 0.508: JP3.1 31.5,23.5 29.87,23.5 29.41,23.03 Q2.2 28.64,21.52 R6.1 | IC3.3 6.07,7.09 C5.1 5.65,7.5 5.37,7.5 3.81,9.07 3.81,9.91 4.32,10.41 4.32,11.68 4.83,12.19 4.83,14.48 1.78,17.53 1.78,22.78 JP1.1 | Q1.3 11.68,24.21 11.68,27.64 v12.32,28.27 12.78,27.81 IC5.6
  Bottom 0.508: JP3.1 31.5,25.15 arc84 15.49,32.38 arc69 v12.32,28.27 arc65 12.12,28.07 10.29,28.07 arc-21 6.9,27.76 arc69 4.06,26.16 JP1.1
VBUS
  Top 0.508: USBC.A4-B9 9.31,19.9 | 9.31,19.9 9.65,19.56 9.65,18.58 10.41,17.82 C4.1 10.87,17.8 JP10.1 | 9.31,19.9 9.65,20.24 9.65,22.33 10.25,22.93 Q1.1 15.94,22.93 D1.A 16.89,22.98 17.03,22.85 R5.2 | IC3.4 9.21,9.21 9.53,9.53 9.53,11.94 9.86,12.27 C3.2 arc90 10.53,12.84 10.03,13.34 10.03,14.81 JP10.1 | JP10.1 10.87,15.57 10.4,15.1 USBC.B4-A9
VDD  (via drill 0.35)
  Top 0.254: C8.2 13.51,4.89 13.51,5.03 | 13.51,5.03 13.51,5.12 C9.1 15.57,5.01 16.69,3.9 16.69,3.72 16.76,3.72 | 13.51,5.03 12.69,5.86 VR1.VOUT 12.75,6.68 R4.2 | C14.2 24.38,31.75 25.25,30.89 IC2.8 IC2.7 | C14.2 22.87,30.23 20.24,27.61 IC2.3 16.82,27.61 v16.71,27.51 | C14.2 22.87,32.5 22.35,33.02 18.8,33.02 | R11.2 5.07,28.18 5.85,28.96 C15.2 8.46,28.96 IC5.2 9.3,29.08 9.96,29.74 9.96,30.38 12.6,33.02 16,33.02 | 22.5,12.01 22.5,12.08 22.17,12.42 18.21,12.42 17.93,12.7 15.24,12.7 14.73,13.21 | 22.5,12.01 22.38,11.88 IC1.17 22.38,9.88 22.86,9.4 23.88,9.4 24.38,8.89 24.38,6.35 | 22.5,12.01 C16.2 23.36,12.18 23.62,12.45 24.38,12.45 24.64,12.7 24.64,14.22 23.88,14.99 23.37,14.99 22.99,15.37 R15.2 | 22.33,4.09 IC1.36 18.01,4.09 17.64,3.72 16.76,3.72 | IC1.44 22.38,4.04 22.33,4.09 | 22.33,4.09 23.9,4.09 24.38,4.57 24.38,6.35 | 24.38,6.35 24.66,6.63 IC1.6 | 16.84,1.96 16.59,1.7 C19.2 | IC6.4 16.98,2 16.89,1.91 16.84,1.96 | IC7.16 15.54,15.55 15.54,15.27 15.12,14.85 C20.2 14.73,14.12 14.73,13.21 | 14.73,13.21 14.22,12.7 13.21,12.7 12.9,13.01 12.9,14.2 12.42,14.68 12.42,15.38 12.72,15.69 12.72,16.58 R16.2 | 16.76,3.72 16.76,2.03 16.84,1.96 | 16,33.02 18.8,33.02 | R13.2 15.5,32.52 16,33.02 | R12.2 18.3,32.52 18.8,33.02 | R14.2 12.95,20.46 v12.62,21.21
  Bottom 0.254: v16.71,27.51 16.51,24.89 arc-44 15.49,22.86 arc44 14.45,20.78 arc-51 13.46,19.05 | v12.62,21.21 13.21,20.45 arc-68 13.46,19.05 | 13.46,19.05 arc1 12.72,17.33 12.72,16.63 R16.2
  other vias: 12.75,16.6

### Text on the board
tPlace: RTC | FLASH | B+ | B+ | RST | SWCLK | S- | S+ | SWDIO | VBUS | GND | GND | VK49 2.0 / xx0x.cz
Document: VK49 2.0 / Vaclav Mach (vaclavmach@hotmail.cz) / Hardware: CC BY-SA 4.0 / Software: CC BY-SA 4.0 / Original sounds: Copyrighted